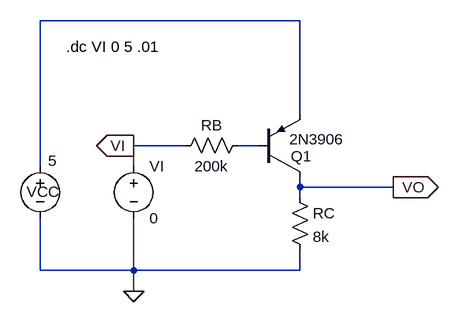
[diagram p0: schematic exam5_06_PNP.asc]
exam5_06_PNP.asc, the LTspice schematic file:
Version 4
SHEET 1 880 680
WIRE 272 -16 -128 -16
WIRE 272 128 272 -16
WIRE 96 176 16 176
WIRE 208 176 176 176
WIRE -128 208 -128 -16
WIRE 16 208 16 176
WIRE 272 240 272 224
WIRE 416 240 272 240
WIRE 272 256 272 240
WIRE -128 368 -128 288
WIRE 16 368 16 288
WIRE 16 368 -128 368
WIRE 272 368 272 336
WIRE 272 368 16 368
WIRE 16 400 16 368
FLAG 16 400 0
FLAG 416 240 VO
IOPIN 416 240 Out
FLAG 16 176 VI
IOPIN 16 176 Out
SYMBOL res 256 240 R0
SYMATTR InstName RC
SYMATTR Value 8k
SYMBOL res 192 160 R90
WINDOW 0 0 56 VBottom 2
WINDOW 3 32 56 VTop 2
SYMATTR InstName RB
SYMATTR Value 200k
SYMBOL voltage 16 192 R0
SYMATTR InstName VI
SYMATTR Value 0
SYMBOL voltage -128 192 R0
WINDOW 0 -21 55 Left 2
WINDOW 3 12 7 Left 2
SYMATTR InstName VCC
SYMATTR Value 5
SYMBOL pnp 208 224 M180
WINDOW 0 50 32 Left 2
WINDOW 3 48 58 Left 2
SYMATTR InstName Q1
SYMATTR Value 2N3906
TEXT -88 24 Left 2 !.dc VI 0 5 .01

The netlist it stands for:
* exam5_06_PNP.asc
RC VO 0 8k
RB N002 VI 200k
VI VI 0 0
VCC N001 0 5
Q1 VO N002 N001 0 2N3906
.model NPN NPN
.model PNP PNP
.lib standard.bjt
.dc VI 0 5 .01
.backanno
.end